# EAGLE schematic flank_detection (EAGLE 7.2.0)
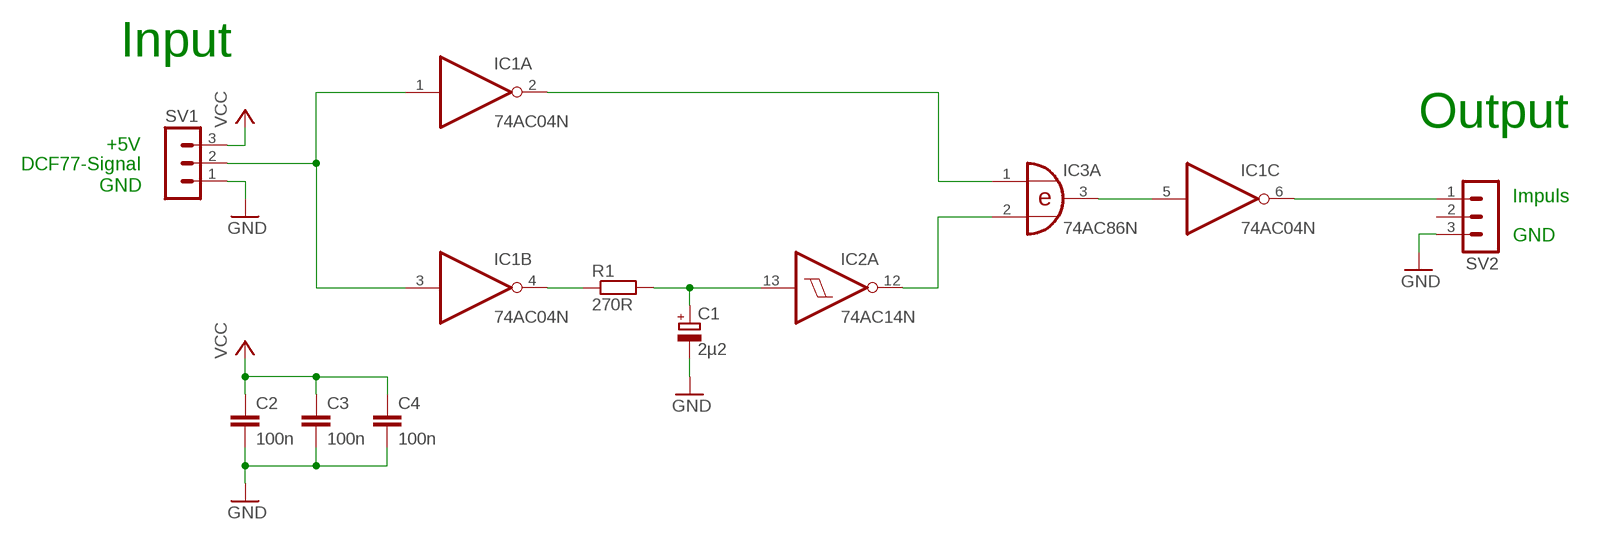
[diagram p0: schematic, sheet 1]

## Parts
C1  2µ2  CPOL-EUE2,5-6E  [E2,5-6E]
C2  100n  C-EU050-024X044  [C050-024X044]
C3  100n  C-EU050-024X044  [C050-024X044]
C4  100n  C-EU050-024X044  [C050-024X044]
IC1  74AC04N  [DIL14]
IC2  74AC14N  [DIL14]
IC3  74AC86N  [DIL14]
R1  270R  R-EU_0204/5  [0204/5]
SV1  MA03-1  [MA03-1]
SV2  MA03-1  [MA03-1]

## Nets
GND: C1.- C2.2 C3.2 C4.2 SV1.1 SV2.3
N$1: IC1.1(A:I) IC1.3(B:I) SV1.2
N$2: IC1.4(B:O) R1.1
N$3: C1.+ IC2.13(A:I) R1.2
N$4: IC1.2(A:O) IC3.1(A:I0)
N$5: IC2.12(A:O) IC3.2(A:I1)
N$6: IC1.5(C:I) IC3.3(A:O)
N$7: IC1.6(C:O) SV2.1
VCC: C2.1 C3.1 C4.1 SV1.3
Unconnected: IC1.8(D:O) IC1.9(D:I) IC1.10(E:O) IC1.11(E:I) IC1.12(F:O) IC1.13(F:I) IC2.1(D:I) IC2.2(D:O) IC2.3(E:I) IC2.4(E:O) IC2.5(F:I) IC2.6(F:O) IC2.8(C:O) IC2.9(C:I) IC2.10(B:O) IC2.11(B:I) IC3.4(B:I0) IC3.5(B:I1) IC3.6(B:O) IC3.8(C:O) IC3.9(C:I0) IC3.10(C:I1) IC3.11(D:O) IC3.12(D:I0) IC3.13(D:I1) SV2.2

## Notes on the sheet
- Input
- Output
- +5V
- DCF77-Signal
- GND
- Impuls
- GND

## Power pins joined to a net without a drawn wire
GND: IC1.7(P:GND) IC2.7(P:GND) IC3.7(P:GND)
VCC: IC1.14(P:VCC) IC2.14(P:VCC) IC3.14(P:VCC)

## Library data of the parts
C1 = resistor:CPOL-EU: POLARIZED CAPACITOR, European symbol
C2-C4 = resistor:C-EU: CAPACITOR, European symbol
IC1 = 74xx-eu:74*04: Hex INVERTER
IC2 = 74xx-eu:74*14: Hex schmitt trigger INVERTER
IC3 = 74xx-eu:74*86: Quad 2-input EXCLUSIVE-OR (XOR) gate
R1 = resistor:R-EU_: RESISTOR, European symbol
SV1 SV2 = con-lstb:MA03-1: PIN HEADER; OC_FARNELL: unknown; OC_NEWARK: unknown